# Altium project PCB_Project.PrjPcb
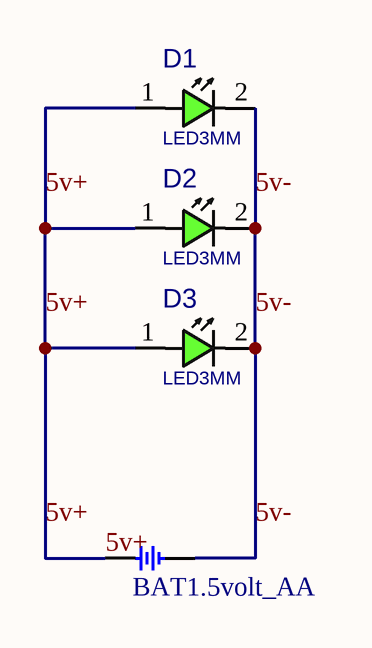
[diagram p0: tamrin1Nima.SchDoc]
1 sheet, 4 parts. Net scope: global (net labels, ports and power ports of the same name join across sheets).
Board file: PCB1.PcbDoc

## Sheet tamrin1Nima.SchDoc
size A; SheetNumber: 1; SheetTotal: 1

### Parts
BT1  BAT1.5volt_AA  [BTH_AA]
D1  LED3MM  [LED3MM]
D2  LED3MM  [LED3MM]
D3  LED3MM  [LED3MM]

### Nets
5v+: BT1.1 D1.1(ANODE) D2.1(ANODE) D3.1(ANODE)
5v-: BT1.2 D1.2(CATHODE) D2.2(CATHODE) D3.2(CATHODE)

### Library data of the parts
BT1 = BATH_AA: BATTERY HOLDER, AA; MANF_P#: Keystone 82; .: http://www.chila.ir; VALUE: BAT1.5volt_AA
D1-D3 = LED_THD_3MM: LED, THD, 3MM, GREEN; DESC: DESCRIPTION; MANF_P#: MANF_PART#; PARAM2: 2.2V; MANF: MANF; ASSEMBLY: ASSEMBLY; PRICE: PRICE; VALUE: LED3MM